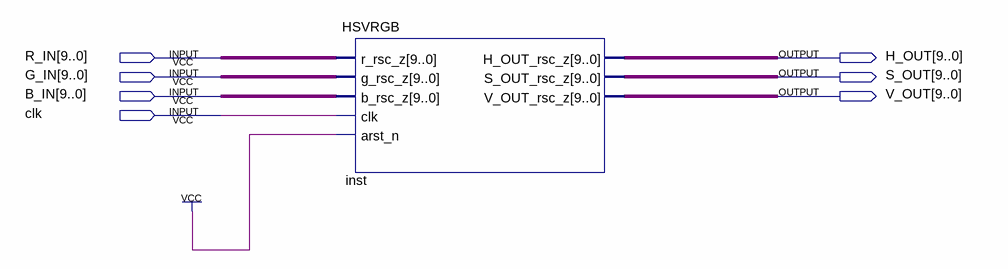
[diagram p0: schematic sheet]
// Quartus schematic TestBench.bdf as structural Verilog: 1 symbols, 7 pins
module TestBench (
  input  [9:0] R_IN,
  input  [9:0] G_IN,
  input  [9:0] B_IN,
  input  clk,
  output [9:0] H_OUT,
  output [9:0] S_OUT,
  output [9:0] V_OUT
);

  HSVRGB inst (
    .r_rsc_z(R_IN), .g_rsc_z(G_IN), .b_rsc_z(B_IN), .clk(clk), .arst_n(1'b1), .H_OUT_rsc_z(H_OUT),
    .S_OUT_rsc_z(S_OUT), .V_OUT_rsc_z(V_OUT));
endmodule
